# EAGLE schematic eCog110_Buzzer (EAGLE 6.6.0)
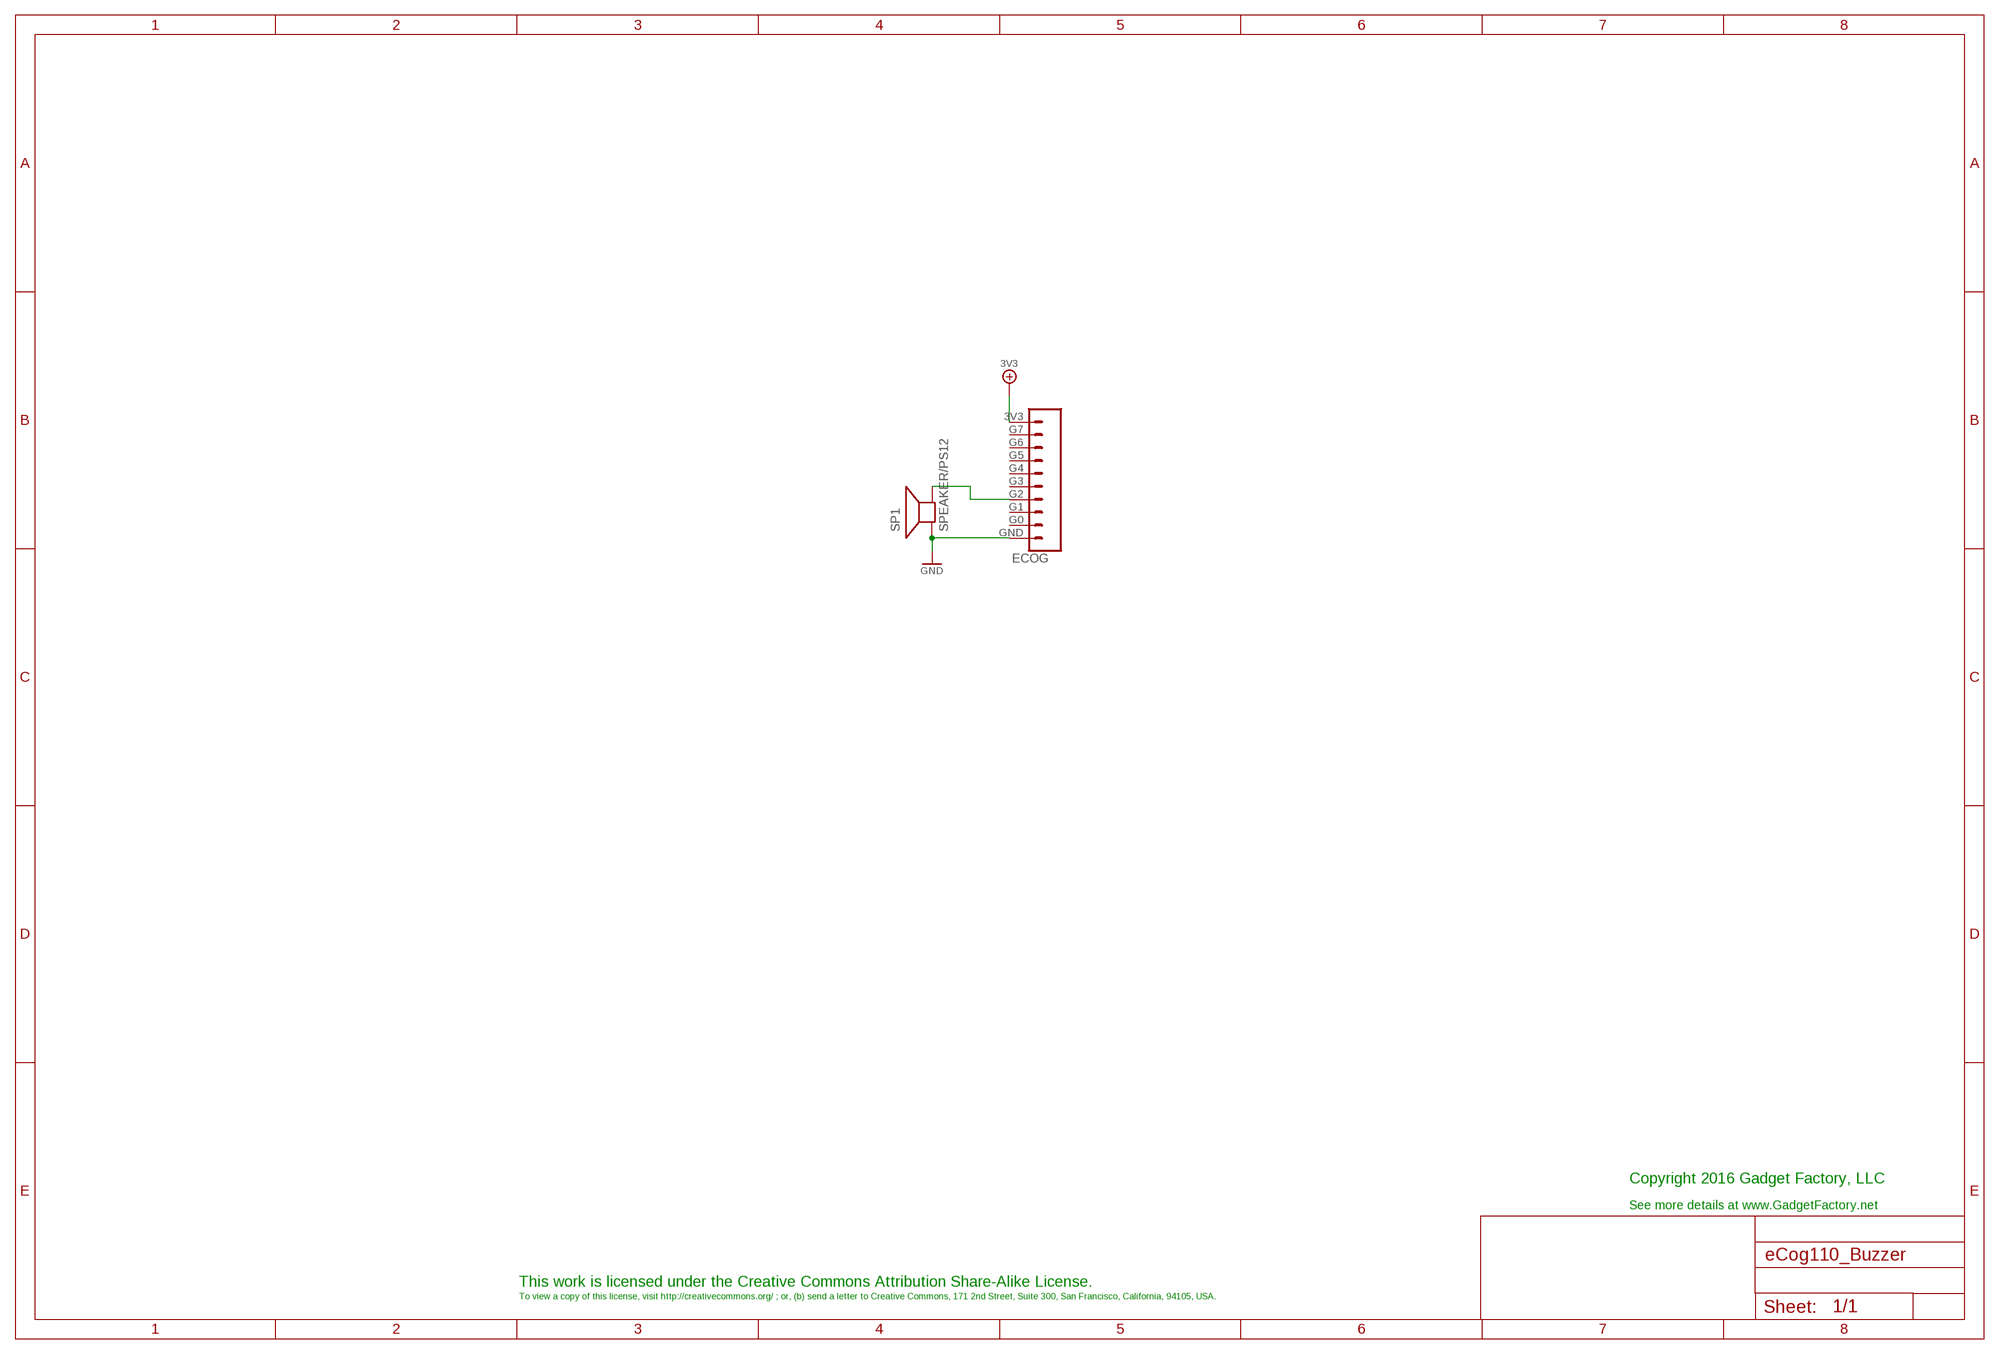
[diagram p0: schematic, sheet 1]

## Parts
ECOG  ECOG_GENERAL_ROWTHROUGHOLE  [ECOG_GENERAL_TH]
SP1  SPEAKER/PS12  [PS12]

## Nets
3V3: ECOG.3V3
GND: ECOG.GND SP1.P$1(+)
N$1: ECOG.G2 SP1.P$2(-)
Unconnected: ECOG.G0 ECOG.G1 ECOG.G3 ECOG.G4 ECOG.G5 ECOG.G6 ECOG.G7

## Notes on the sheet
- Copyright 2016 Gadget Factory, LLC
- See more details at www.GadgetFactory.net
- This work is licensed under the Creative Commons Attribution Share-Alike License.
- To view a copy of this license, visit http://creativecommons.org/ ; or, (b) send a letter to Creative Commons, 171 2nd Street, Suite 300, San Francisco, California, 94105, USA.

## Library data of the parts
ECOG = eCogs:ECOG_GENERAL_ROW; PARTNO: NREC010SABC-M30RC,SULLINS CONNECTOR SOLUTIONS,dk,S1013EC-10-ND,"10 Positions Header, Unshrouded Connector 0.100"" (2.54mm) Surface Mount Tin eCog", REF78
SP1 = adafruit:SPEAKER: SPEAKER Source: Buerklin Added PS12 (for part # PS1240 piezo) http://www.ladyada.net/library/pcb/eaglelibrary.html; DIGIKEY: 445-2525-1-ND; PARTNO: PS1240P02BT,TDK CORPORATION (VA),dk,445-2525-1-ND,"Zero-Peak Signal Buzzer Single Tone 4kHz Piezo 30V (Max) 60dB @ 3V, 10cm ", REF77